# Altium schematic sheet [04]-Connector.SchDoc: ENTER SHEET TITLE
size B; Engineer: ENTER ENGINEER NAME; Organization: CUAir; Address1: L3, 12a Rodborough Rd; Address2: Frenchs Forest; Address3: NSW; Address4: Australia 2086; Revision: ENTER REVISION NUMBER; CompetitionYear: 2019; CPN: ENTER CPN; PROJECT: ENTER PROJECT NAME
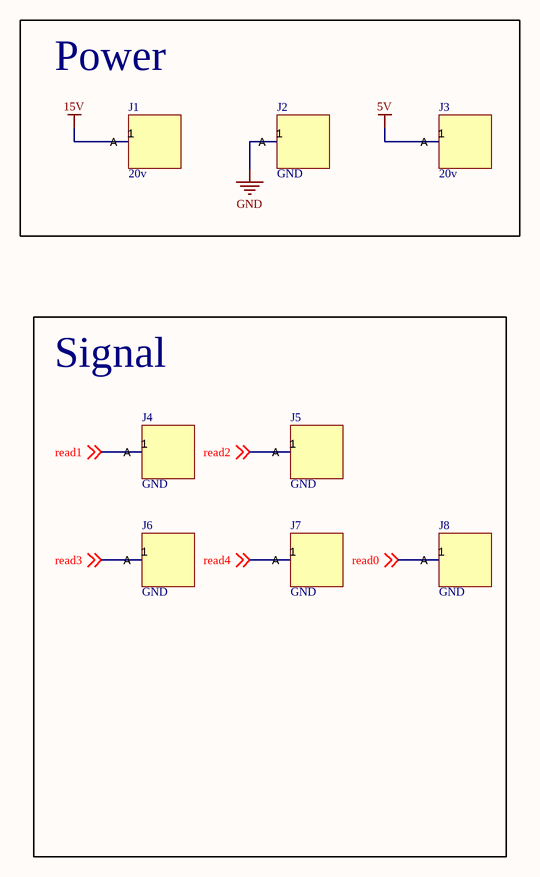
[diagram p0: [04]-Connector.SchDoc]

## Parts
J1  20v  [PIN]
J2  GND  [PIN]
J3  20v  [PIN]
J4  GND  [PIN]
J5  GND  [PIN]
J6  GND  [PIN]
J7  GND  [PIN]
J8  GND  [PIN]

## Blocks framed on the sheet
Power: J1-J3
Signal: J4-J8

## Nets
5V: J3.1(A)
15V: J1.1(A)
GND: J2.1(A)
read0: J8.1(A) ; off-sheet read0
read1: J4.1(A) ; off-sheet read1
read2: J5.1(A) ; off-sheet read2
read3: J6.1(A) ; off-sheet read3
read4: J7.1(A) ; off-sheet read4

## Notes on the sheet
- Project
- Title
- Size:
- Date:
- B
- Number:
- Revision:
- File: